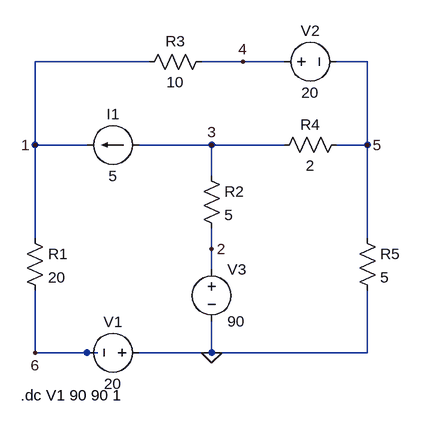
[diagram p0: schematic draftcc1.asc]
draftcc1.asc, the LTspice schematic file:
Version 4
SHEET 1 880 680
WIRE 80 -192 -96 -192
WIRE 224 -192 160 -192
WIRE 288 -192 224 -192
WIRE 416 -192 368 -192
WIRE -96 -64 -96 -192
WIRE -16 -64 -96 -64
WIRE 176 -64 64 -64
WIRE 288 -64 176 -64
WIRE 416 -64 416 -192
WIRE 416 -64 368 -64
WIRE 176 -16 176 -64
WIRE -96 80 -96 -64
WIRE 416 80 416 -64
WIRE 176 96 176 64
WIRE 176 128 176 96
WIRE -96 256 -96 160
WIRE -16 256 -96 256
WIRE 0 256 -16 256
WIRE 176 256 176 208
WIRE 176 256 64 256
WIRE 416 256 416 160
WIRE 416 256 176 256
FLAG 176 256 0
FLAG -96 -64 1
FLAG 176 96 2
FLAG 176 -64 3
FLAG 416 -64 5
FLAG -96 256 6
FLAG 224 -192 4
SYMBOL voltage 80 256 R90
WINDOW 0 -32 56 VBottom 2
WINDOW 3 32 56 VTop 2
WINDOW 123 0 0 Left 0
WINDOW 39 0 0 Left 0
SYMATTR InstName V1
SYMATTR Value 20
SYMBOL voltage 176 112 R0
WINDOW 123 0 0 Left 0
WINDOW 39 0 0 Left 0
SYMATTR InstName V3
SYMATTR Value 90
SYMBOL res -112 64 R0
SYMATTR InstName R1
SYMATTR Value 20
SYMBOL voltage 272 -192 R270
WINDOW 0 32 56 VTop 2
WINDOW 3 -32 56 VBottom 2
WINDOW 123 0 0 Left 0
WINDOW 39 0 0 Left 0
SYMATTR InstName V2
SYMATTR Value 20
SYMBOL res 384 -80 R90
WINDOW 0 0 56 VBottom 2
WINDOW 3 32 56 VTop 2
SYMATTR InstName R4
SYMATTR Value 2
SYMBOL res 176 -208 R90
WINDOW 0 0 56 VBottom 2
WINDOW 3 32 56 VTop 2
SYMATTR InstName R3
SYMATTR Value 10
SYMBOL current 64 -64 R90
WINDOW 0 -32 40 VBottom 2
WINDOW 3 32 40 VTop 2
WINDOW 123 0 0 Left 0
WINDOW 39 0 0 Left 0
SYMATTR InstName I1
SYMATTR Value 5
SYMBOL res 160 -32 R0
SYMATTR InstName R2
SYMATTR Value 5
SYMBOL res 400 64 R0
SYMATTR InstName R5
SYMATTR Value 5
TEXT -118 322 Left 2 !.dc V1 90 90 1

The netlist it stands for:
* draftcc1.asc
V1 0 6 20
V3 2 0 90
R1 1 6 20
V2 4 5 20
R4 5 3 2
R3 4 1 10
I1 3 1 5
R2 3 2 5
R5 5 0 5
.dc V1 90 90 1
.backanno
.end

* Results of the author's LTspice run, read from the files saved beside the schematic
* DC transfer characteristic:
*   v1 = 90 
*   V(6) = -90 V
*   V(2) = 90 V
*   V(1) = 32.53 V
*   V(4) = 43.8 V
*   V(5) = 23.8 V
*   V(3) = 35.57 V
*   I(I1) = 5 A
*   I(R5) = 4.759 A
*   I(R2) = -10.89 A
*   I(R3) = 1.127 A
*   I(R4) = -5.886 A
*   I(R1) = 6.127 A
*   I(V2) = -1.127 A
*   I(V3) = -10.89 A
*   I(V1) = -6.127 A